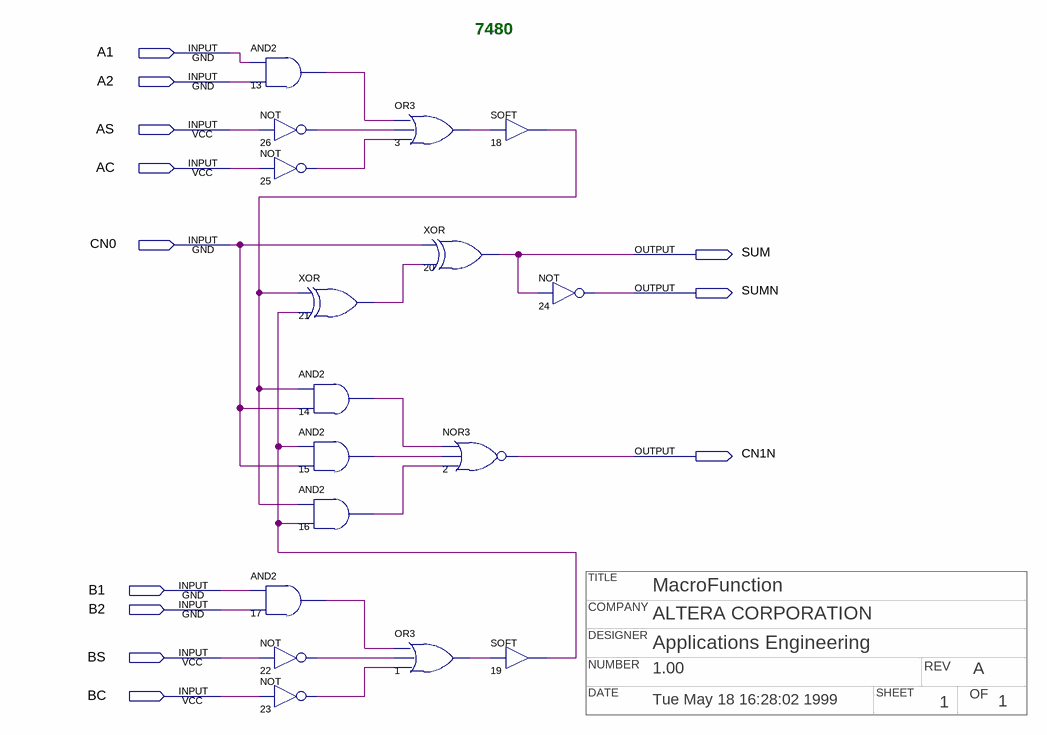
[diagram p0: schematic sheet]
// Quartus schematic 7480.bdf as structural Verilog: 17 symbols, 12 pins
// Title block: TITLE: MacroFunction; COMPANY: ALTERA CORPORATION; DESIGNER: Applications Engineering; NUMBER: 1.00; REV: A; DATE: Tue May 18 16:28:02 1999; SHEET: 1; OF: 1
module \7480  (
  input  A1,
  input  A2,
  input  AS,
  input  AC,
  input  CN0,
  input  B1,
  input  B2,
  input  BS,
  input  BC,
  output SUM,
  output SUMN,
  output CN1N
);

  wire n1_out, n3_out, n13_out, n14_out, n15_out, n16_out, n17_out, n18_out, n19_out, n21_out, n22_out,
       n23_out, n25_out, n26_out;

  and u_13 (n13_out, A1, A2);
  not u_26 (n26_out, AS);
  not u_25 (n25_out, AC);
  and u_17 (n17_out, B1, B2);
  not u_22 (n22_out, BS);
  not u_23 (n23_out, BC);
  xor u_21 (n21_out, n18_out, n19_out);
  and u_14 (n14_out, n18_out, CN0);
  and u_15 (n15_out, n19_out, CN0);
  and u_16 (n16_out, n18_out, n19_out);
  or u_3 (n3_out, n13_out, n26_out, n25_out);
  xor u_20 (SUM, CN0, n21_out);
  or u_1 (n1_out, n17_out, n22_out, n23_out);
  SOFT u_18 (.IN(n3_out), .OUT(n18_out));
  nor u_2 (CN1N, n14_out, n15_out, n16_out);
  SOFT u_19 (.IN(n1_out), .OUT(n19_out));
  not u_24 (SUMN, SUM);

  // Notes on the sheet:
  //   7480
endmodule
